# Altium schematic sheet IMU.SchDoc: IMU Sub-board
size Letter; CompanyName: Hello Inc.; DrawnBy: John Kelley; Organization: Hello Inc.; Revision: EVT2; SheetNumber: 3; SheetTotal: 8
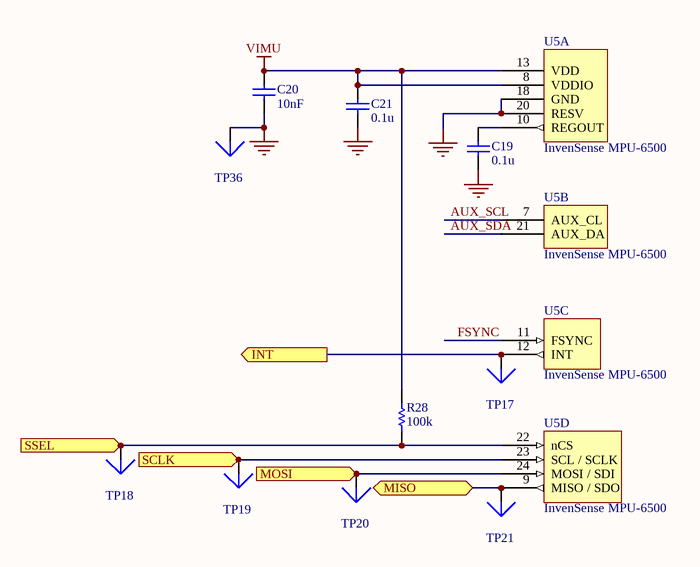
[diagram p0: IMU.SchDoc]

## Parts
C19  0.1u  [CAP0201]
C20  10nF  [CAP0201]
C21  0.1u  [CAP0201]
R28  100k  [RES0201]
TP17  TestPoint  [TP-0.3]  (value not drawn)
TP18  TestPoint  [TP-0.3]  (value not drawn)
TP19  TestPoint  [TP-0.3]  (value not drawn)
TP20  TestPoint  [TP-0.3]  (value not drawn)
TP21  TestPoint  [TP-0.3]  (value not drawn)
TP36  TestPoint  [TP-0.3]  (value not drawn)
U5  InvenSense MPU-6500  [QFN-24]  (parts A,B,C,D of 4)

## Ports
INT (out), MISO, MOSI (in), SCLK (in), SSEL (in)

## Nets
GND: C19.1 C20.1 C21.1 TP36.1 U5.18(GND) U5.20(RESV)
VIMU: C20.2 C21.2 R28.2 U5.8(VDDIO) U5.13(VDD)
AUX_SCL: U5.7(AUX_CL)
AUX_SDA: U5.21(AUX_DA)
FSYNC: U5.11(FSYNC)
INT: TP17.1 U5.12(INT) ; port INT
MISO: TP21.1 U5.9(MISO_/_SDO) ; port MISO
MOSI: TP20.1 U5.24(MOSI_/_SDI) ; port MOSI
SCLK: TP19.1 U5.23(SCL_/_SCLK) ; port SCLK
SSEL: R28.1 TP18.1 U5.22(nCS) ; port SSEL
NetC19_2: C19.2 U5.10(REGOUT)

## Notes on the sheet
- TITLE
- DATE
- DRAWN BY
- REV
- SHEET
- OF

## Library data of the parts
C19 C21 = C_0.1u_10_10_X5R_0201: Chip capacitor; Vendor: Taiyo Yuden; PN: LMK063BJ104KP-F; Tolerance: 10%; Voltage: 10V; Temp: X5R; Value: 0.1u; Size: 0201
C20 = CAP0201: Chip capacitor; Vendor: Murata; Model: GRM033R70J103KA01D; Voltage: 6.3v; Temp: X7R; Tolerance: 10%; Value: 10nF; Size: 0201
R28 = R_100k_5_0.05_0201: Chip Resistor; Vendor: Panasonic; Tolerance: 5 %; Power: 0.05 W; PN: ERJ-1GEJ104C; Model: *; Value: 100k; Size: 0201
TP17-TP21 TP36 = TestPoint: Generic Test Point
U5 = MPU-6500: InvenSense MPU-6500 6-axis accelerometer and gyroscope